# EAGLE design Radii (EAGLE 9.5.1)
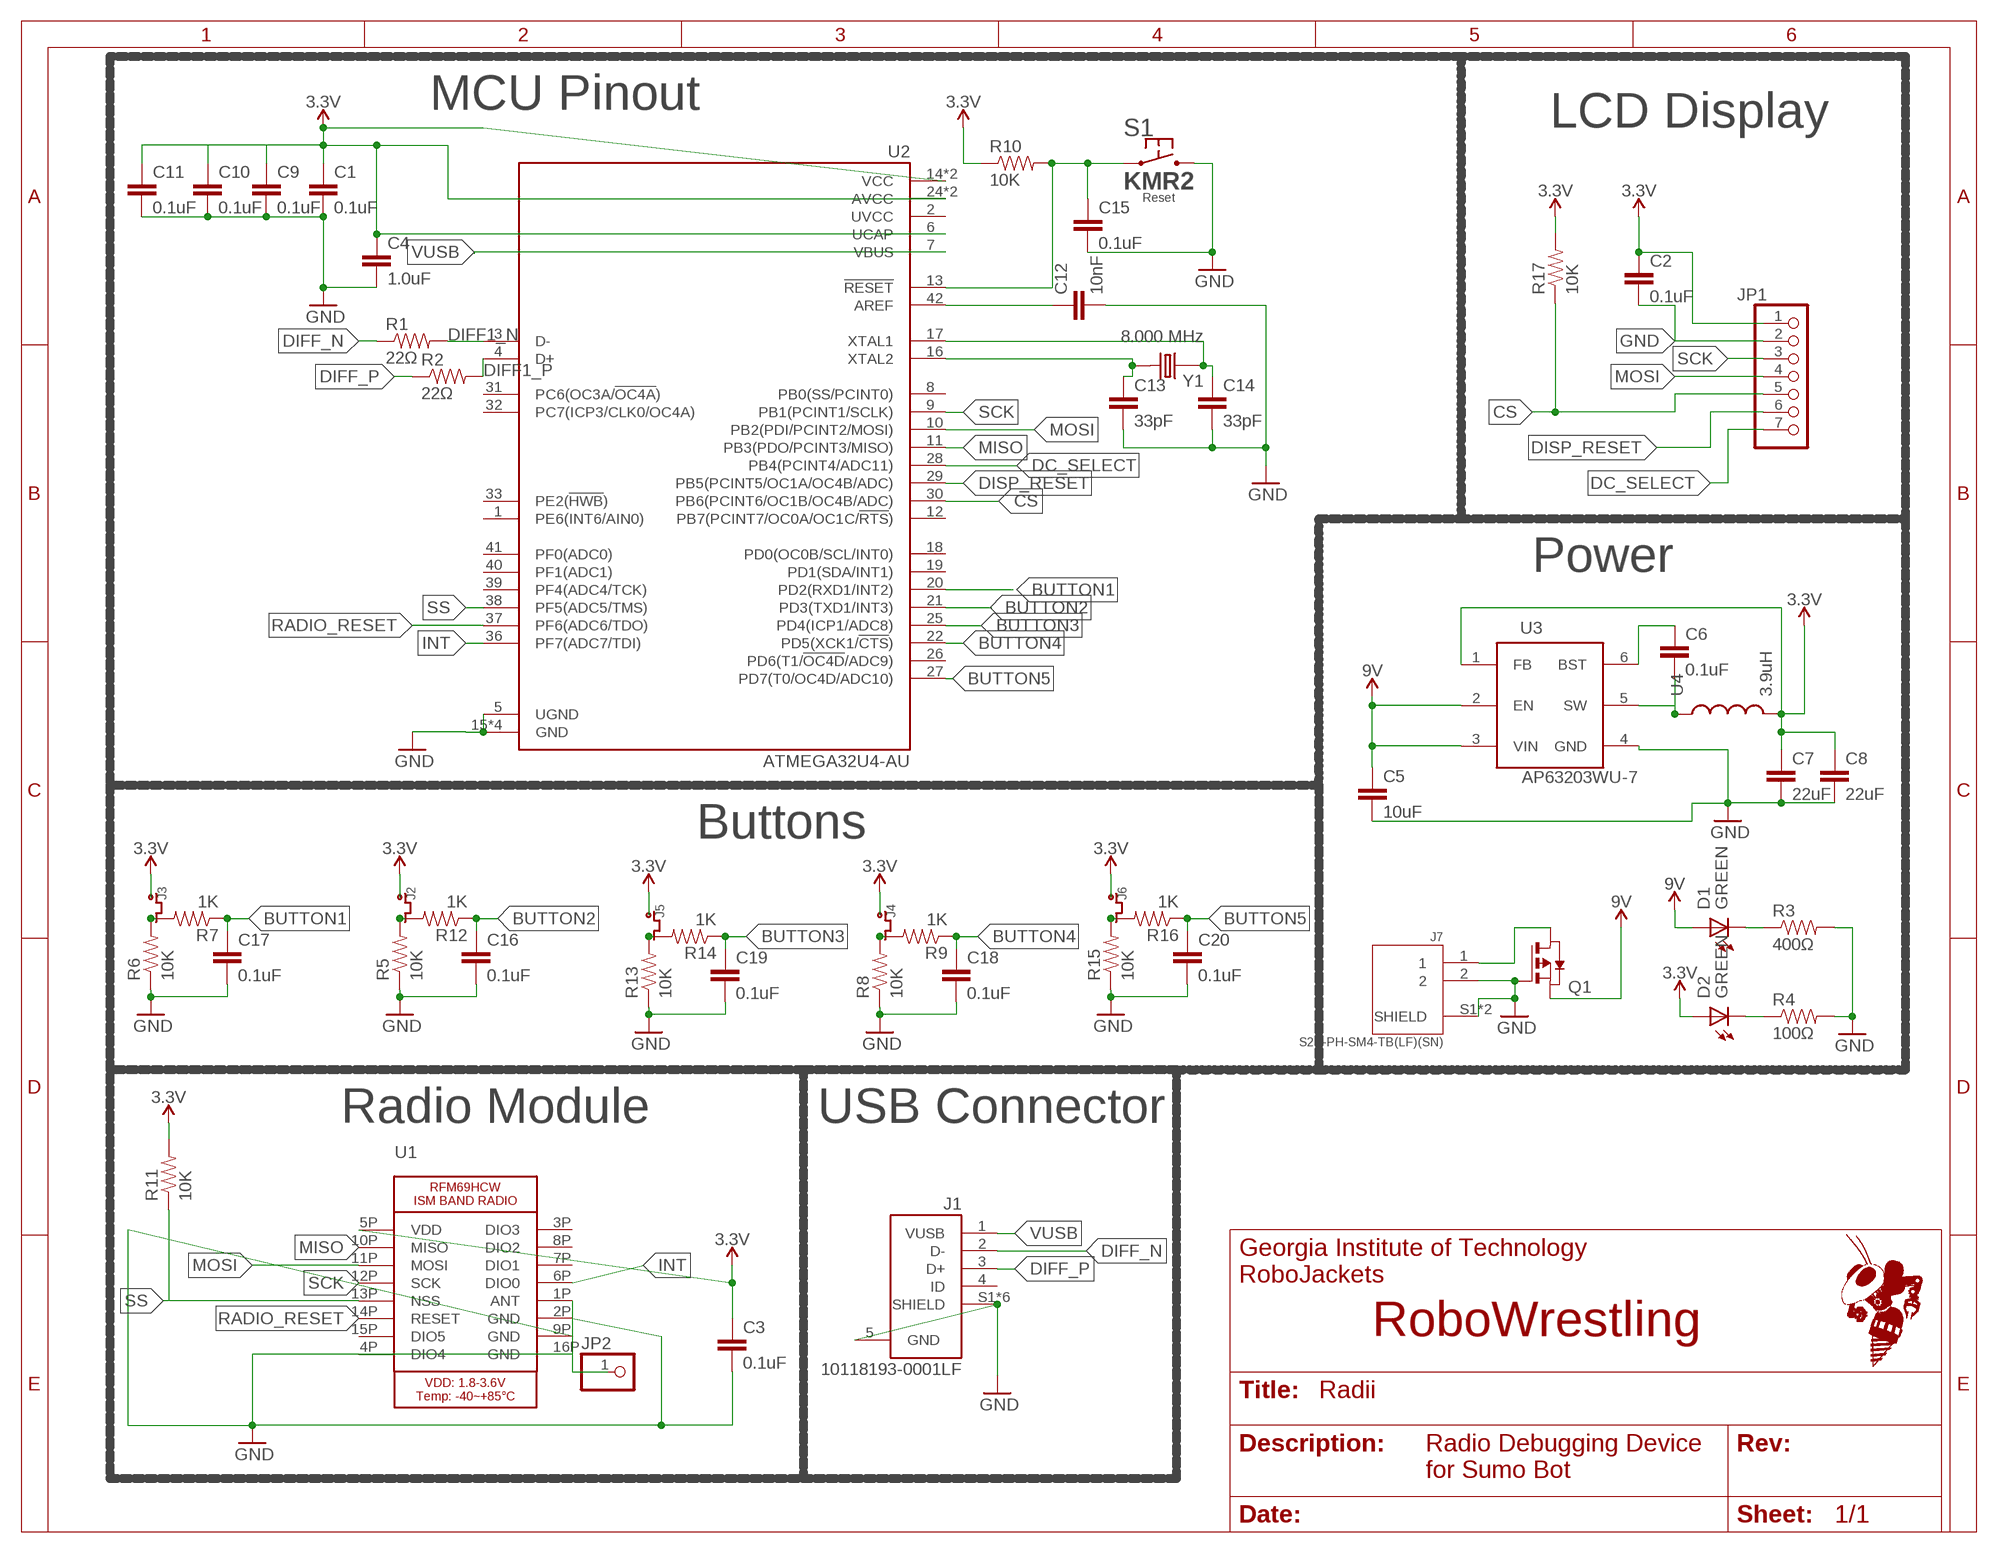
[diagram p0: schematic, sheet 1]

## Parts
C1  0.1uF  0.1UF-0603-25V-(+80/-20%)  [0603]
C2  0.1uF  0.1UF-0603-25V-(+80/-20%)  [0603]
C3  0.1uF  0.1UF-0603-25V-(+80/-20%)  [0603]
C4  1.0uF  1.0UF-0603-16V-10%  [0603]
C5  10uF  10UF-0603-6.3V-20%  [0603]
C6  0.1uF  0.1UF-0603-25V-(+80/-20%)  [0603]
C7  22uF  22UF-1210-16V-20%  [1210]
C8  22uF  22UF-1210-16V-20%  [1210]
C9  0.1uF  0.1UF-0603-25V-(+80/-20%)  [0603]
C10  0.1uF  0.1UF-0603-25V-(+80/-20%)  [0603]
C11  0.1uF  0.1UF-0603-25V-(+80/-20%)  [0603]
C12  10nF  10NF-0603-50V-10%  [0603]
C13  33pF  33PF-0603-50V-5%  [0603]
C14  33pF  33PF-0603-50V-5%  [0603]
C15  0.1uF  0.1UF-0603-25V-(+80/-20%)  [0603]
C16  0.1uF  0.1UF-0603-25V-(+80/-20%)  [0603]
C17  0.1uF  0.1UF-0603-25V-(+80/-20%)  [0603]
C18  0.1uF  0.1UF-0603-25V-(+80/-20%)  [0603]
C19  0.1uF  0.1UF-0603-25V-(+80/-20%)  [0603]
C20  0.1uF  0.1UF-0603-25V-(+80/-20%)  [0603]
D1  GREEN  LED-SMD  [CHIP-LED0603]
D2  GREEN  LED-SMD  [CHIP-LED0603]
J1  10118193-0001LF  [FCI_10118193-0001LF]
J2  BUTTON  [1X02]
J3  BUTTON  [1X02]
J4  BUTTON  [1X02]
J5  BUTTON  [1X02]
J6  BUTTON  [1X02]
J7  S2B-PH-SM4-TB(LF)(SN)  [JST_S2B-PH-SM4-TB(LF)(SN)]
JP1  PINHD-1X7  [1X07]
JP2  PINHD-1X1  [1X01]
Q1  PMOS  [SOT-23-3]
R1  22Ω  22OHM1/10W1%(0603)  [0603-RES]
R2  22Ω  22OHM1/10W1%(0603)  [0603-RES]
R3  400Ω  RESISTOR0603  [0603-RES]
R4  100Ω  RESISTOR0603  [0603-RES]
R5  10K  10KOHM-1/10W-1%(0603)0603  [0603-RES]
R6  10K  10KOHM-1/10W-1%(0603)0603  [0603-RES]
R7  1K  10KOHM-1/10W-1%(0603)0603  [0603-RES]
R8  10K  10KOHM-1/10W-1%(0603)0603  [0603-RES]
R9  1K  10KOHM-1/10W-1%(0603)0603  [0603-RES]
R10  10K  10KOHM-1/10W-1%(0603)0603  [0603-RES]
R11  10K  10KOHM-1/10W-1%(0603)0603  [0603-RES]
R12  1K  10KOHM-1/10W-1%(0603)0603  [0603-RES]
R13  10K  10KOHM-1/10W-1%(0603)0603  [0603-RES]
R14  1K  10KOHM-1/10W-1%(0603)0603  [0603-RES]
R15  10K  10KOHM-1/10W-1%(0603)0603  [0603-RES]
R16  1K  10KOHM-1/10W-1%(0603)0603  [0603-RES]
R17  10K  10KOHM-1/10W-1%(0603)0603  [0603-RES]
S1  KMR2  [KMR2]
U1  RFM69HCW_SMT  [RFMHCW_SMT]
U2  ATMEGA32U4-AU  ATMEGA32U4-AUR  [44-TQFP(10X10)]
U3  AP63203WU-7  [TSOT-23-6]
U4  3.9uH  1255AY-3R9N=P3  [1255AY-3R9N=P3]
Y1  8.000 MHz  ECS-80-20-5PX-TR  [XTAL_ECS-80-20-5PX-TR]

## Nets
3.3V: C1.1 C2.1 C3.1 C4.1 C7.1 C8.1 C9.1 C10.1 C11.1 D2.A J2.1 J3.1 J4.1 J5.1 J6.1 JP1.1 R10.1 R11.2 R17.2 U1.5P(VDD) U2.6(UCAP) U2.14(VCC) U2.24(AVCC) U2.34(VCC) U2.44(AVCC) U3.1(FB) U4.2
9V: C5.1 D1.A Q1.2(S) U3.2(EN) U3.3(VIN)
BUTTON1: C17.1 R7.1 U2.20(PD2(RXD1/INT2))
BUTTON2: C16.1 R12.1 U2.21(PD3(TXD1/INT3))
BUTTON3: C19.1 R14.1 U2.25(PD4(ICP1/ADC8))
BUTTON4: C18.1 R9.1 U2.22(PD5(XCK1/!CTS!))
BUTTON5: C20.1 R16.1 U2.27(PD7(T0/OC4D/ADC10))
CS: JP1.5 R17.1 U2.30(PB6(PCINT6/OC1B/OC4B/ADC))
DC_SELECT: JP1.7 U2.28(PB4(PCINT4/ADC11))
DIFF1_N: R1.2 U2.3(D-)
DIFF1_P: R2.2 U2.4(D+)
DIFF_N [diff]: J1.2(D-) R1.1
DIFF_P [diff]: J1.3(D+) R2.1
DISP_RESET: JP1.6 U2.29(PB5(PCINT5/OC1A/OC4B/ADC))
GND: C1.2 C2.2 C3.2 C4.2 C5.2 C7.2 C8.2 C9.2 C10.2 C11.2 C12.2 C13.2 C14.2 C15.2 C16.2 C17.2 C18.2 C19.2 C20.2 J1.5(GND) J1.S1(SHIELD) J1.S2(SHIELD) J1.S3(SHIELD) J1.S4(SHIELD) J1.S5(SHIELD) J1.S6(SHIELD) J7.2 J7.S1(SHIELD) J7.S2(SHIELD) JP1.2 Q1.1(G) R3.2 R4.2 R5.1 R6.1 R8.1 R13.1 R15.1 S1.2.1 S1.2.2 U1.2P(GND) U1.9P(GND) U1.16P(GND) U2.5(UGND) U2.15(GND) U2.23(GND) U2.35(GND) U2.43(GND) U3.4(GND)
INT: U1.6P(DIO0) U2.36(PF7(ADC7/TDI))
MISO: U1.10P(MISO) U2.11(PB3(PDO/PCINT3/MISO))
MOSI: JP1.4 U1.11P(MOSI) U2.10(PB2(PDI/PCINT2/MOSI))
N$1: C6.2 U3.5(SW) U4.1
N$2: C6.1 U3.6(BST)
N$3: JP2.1 U1.1P(ANT)
N$4: J3.2 R6.2 R7.2
N$6: C13.1 U2.16(XTAL2) Y1.2
N$7: C12.1 U2.42(AREF)
N$8: C14.1 U2.17(XTAL1) Y1.1
N$9: D1.C(K) R3.1
N$10: D2.C(K) R4.1
N$11: J2.2 R5.2 R12.2
N$12: J4.2 R8.2 R9.2
N$13: J5.2 R13.2 R14.2
N$14: J6.2 R15.2 R16.2
N$17: C15.1 R10.2 S1.1.1 S1.1.2 U2.13(!RESET)
RADIO_RESET: U1.14P(RESET) U2.37(PF6(ADC6/TDO))
SCK: JP1.3 U1.12P(SCK) U2.9(PB1(PCINT1/SCLK))
SS: R11.1 U1.13P(NSS) U2.38(PF5(ADC5/TMS))
VCC: J7.1 Q1.3(D)
VUSB: J1.1(VUSB) U2.7(VBUS)
Unconnected: J1.4(ID) U1.3P(DIO3) U1.4P(DIO4) U1.7P(DIO1) U1.8P(DIO2) U1.15P(DIO5) U2.1(PE6(INT6/AIN0)) U2.2(UVCC) U2.8(PB0(SS/PCINT0)) U2.12(PB7(PCINT7/OC0A/OC1C/!RTS!)) U2.18(PD0(OC0B/SCL/INT0)) U2.19(PD1(SDA/INT1)) U2.26(PD6(T1/!OC4D!/ADC9)) U2.31(PC6(OC3A/!OC4A!)) U2.32(PC7(ICP3/CLK0/OC4A)) U2.33(PE2(!HWB!)) U2.39(PF4(ADC4/TCK)) U2.40(PF1(ADC1)) U2.41(PF0(ADC0))

## Notes on the sheet
- MCU Pinout
- LCD Display
- Power
- Buttons
- Radio Module | USB Connector
- RoboWrestling
- Radio Debugging Device 
  for Sumo Bot

## Library data of the parts
C1-C3 C6 C9-C11 C15-C20 = SparkFun-Capacitors:0.1UF: 0.1µF ceramic capacitors A capacitor is a passive two-terminal electrical component used to store electrical energy temporarily in an electric field.; PROD_ID: CAP-00810
C4 = SparkFun-Capacitors:1.0UF: 1µF ceramic capacitors A capacitor is a passive two-terminal electrical component used to store electrical energy temporarily in an electric field.; PROD_ID: CAP-00868
C5 = SparkFun-Capacitors:10UF: 10.0µF ceramic capacitors A capacitor is a passive two-terminal electrical component used to store electrical energy temporarily in an electric field.; PROD_ID: CAP-11015
C7 C8 = SparkFun-Capacitors:22UF: 22µF ceramic capacitors A capacitor is a passive two-terminal electrical component used to store electrical energy temporarily in an electric field.
C12 = SparkFun-Capacitors:10NF: 0.01uF/10nF/10,000pF ceramic capacitors A capacitor is a passive two-terminal electrical component used to store electrical energy temporarily in an electric field. CAP-09321; PROD_ID: CAP-00867
C13 C14 = SparkFun-Capacitors:33PF: 33pF ceramic capacitors A capacitor is a passive two-terminal electrical component used to store electrical energy temporarily in an electric field.; PROD_ID: CAP-10142
D1 D2 = RoboJackets-LEDs:LED-SMD
J1 = I'mRADIOactive:10118193-0001LF: Micro USB B Type Receptacle; DKPN: 609-4616-1-ND
J2-J6 = I'mRADIOactive:BUTTON: Connector for a simple external button
J7 = I'mRADIOactive:S2B-PH-SM4-TB(LF)(SN): PH Series 2 Position 2 mm Pitch Surface Mount Side Entry Shrouded Header; DIGI-KEY_PART_NUMBER: 455-1749-1-ND
JP1 = I'mRADIOactive:PINHD-1X7: 7 PIN HEADER
JP2 = pinhead:PINHD-1X1: PIN HEADER
Q1 = RoboJackets-Discrete:PMOS
R1 R2 = SparkFun-Resistors:22OHM1/10W1%(0603): RES-08698; PROD_ID: RES-08698; VALUE: 22
R3 R4 = SparkFun-Resistors:RESISTOR: Resistor Basic schematic elements and footprints for 0603, 1206, and PTH resistors.
R5 R6 R8 R10 R11 R13 R15 R17 = SparkFun-Resistors:10KOHM-1/10W-1%(0603): RES-00824; PROD_ID: RES-00824
R7 R9 R12 R14 R16 = SparkFun-Resistors:10KOHM-1/10W-1%(0603): RES-00824; PROD_ID: RES-00824; VALUE: 10K
S1 = RoboJackets-Switches:KMR2; FUNCTION: Reset
U1 = I'mRADIOactive:RFM69HCW: RFM69HCW - ISM Band RF Transceiver; DKPN: 1568-1394-ND
U2 = I'mRADIOactive:ATMEGA32U4-AUR: ATmega Series 16 MHz 32 KB Flash 2.5 KB SRAM 8-Bit Microcontroller - TQFP-44; DKPN: ATMEGA32U4-AURDKR-ND
U3 = I'mRADIOactive:AP63203WU-7: 3.3V Switching Step-Down Power Regulator, Max Input 32V; DKPN: AP63203WU-7DICT-ND
U4 = I'mRADIOactive:1255AY-3R9N=P3: 3.9uH Inductor; DKPN: 490-14062-1-ND; SATURATION: 4.7A; TOLERANCE: ±30%
Y1 = I'mRADIOactive:ECS-80-20-5PX-TR: CRYSTAL SMD; DKPN: XC1271CT-ND

## Net classes
1 diff: width 0.004 mm

## Board
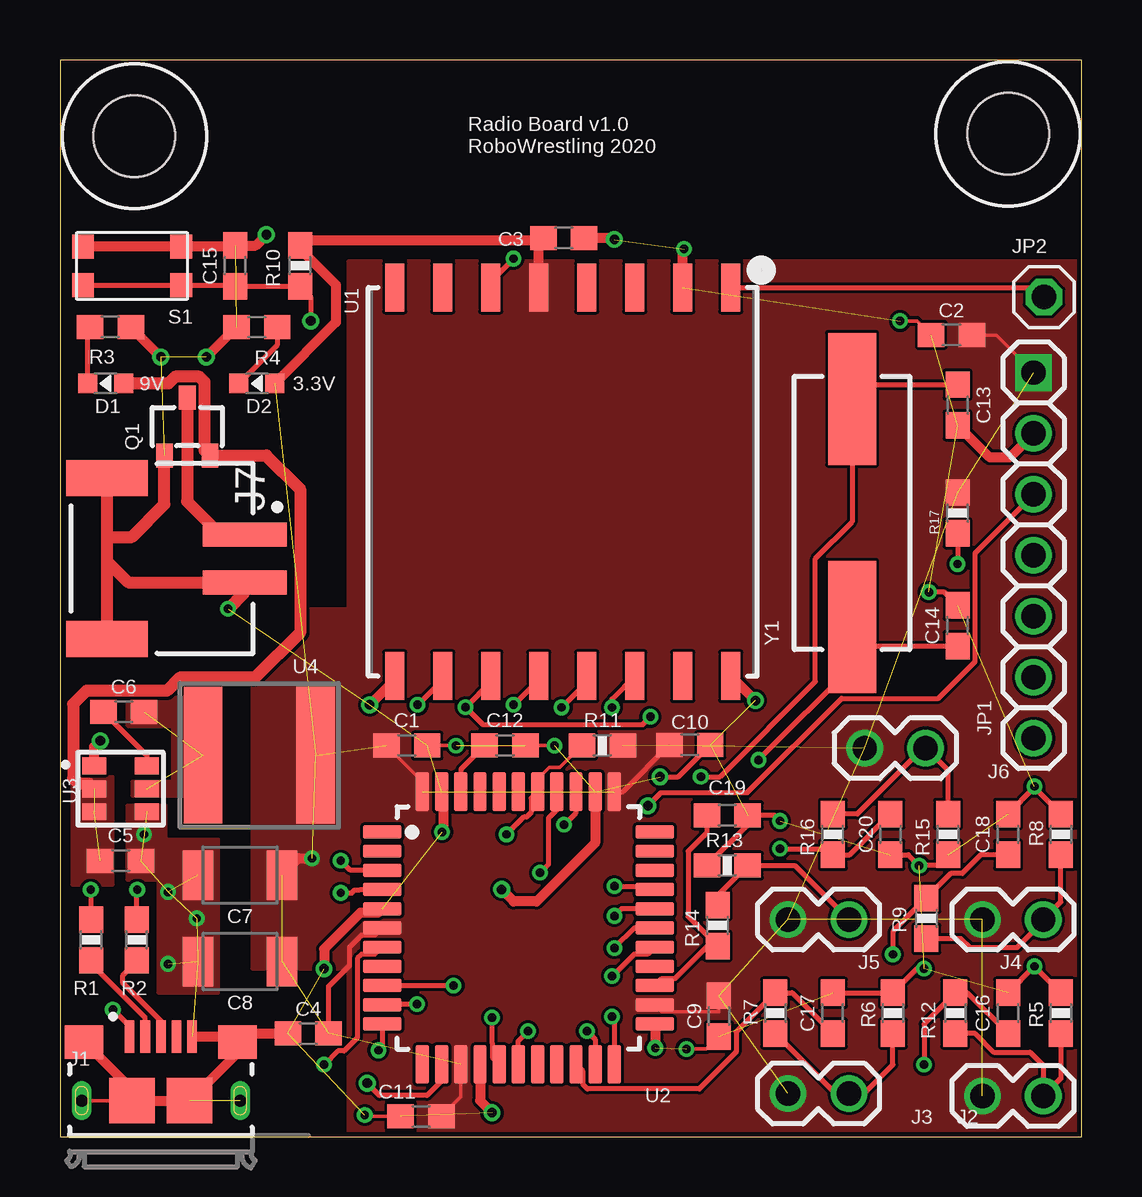
[diagram p1: board, top side]
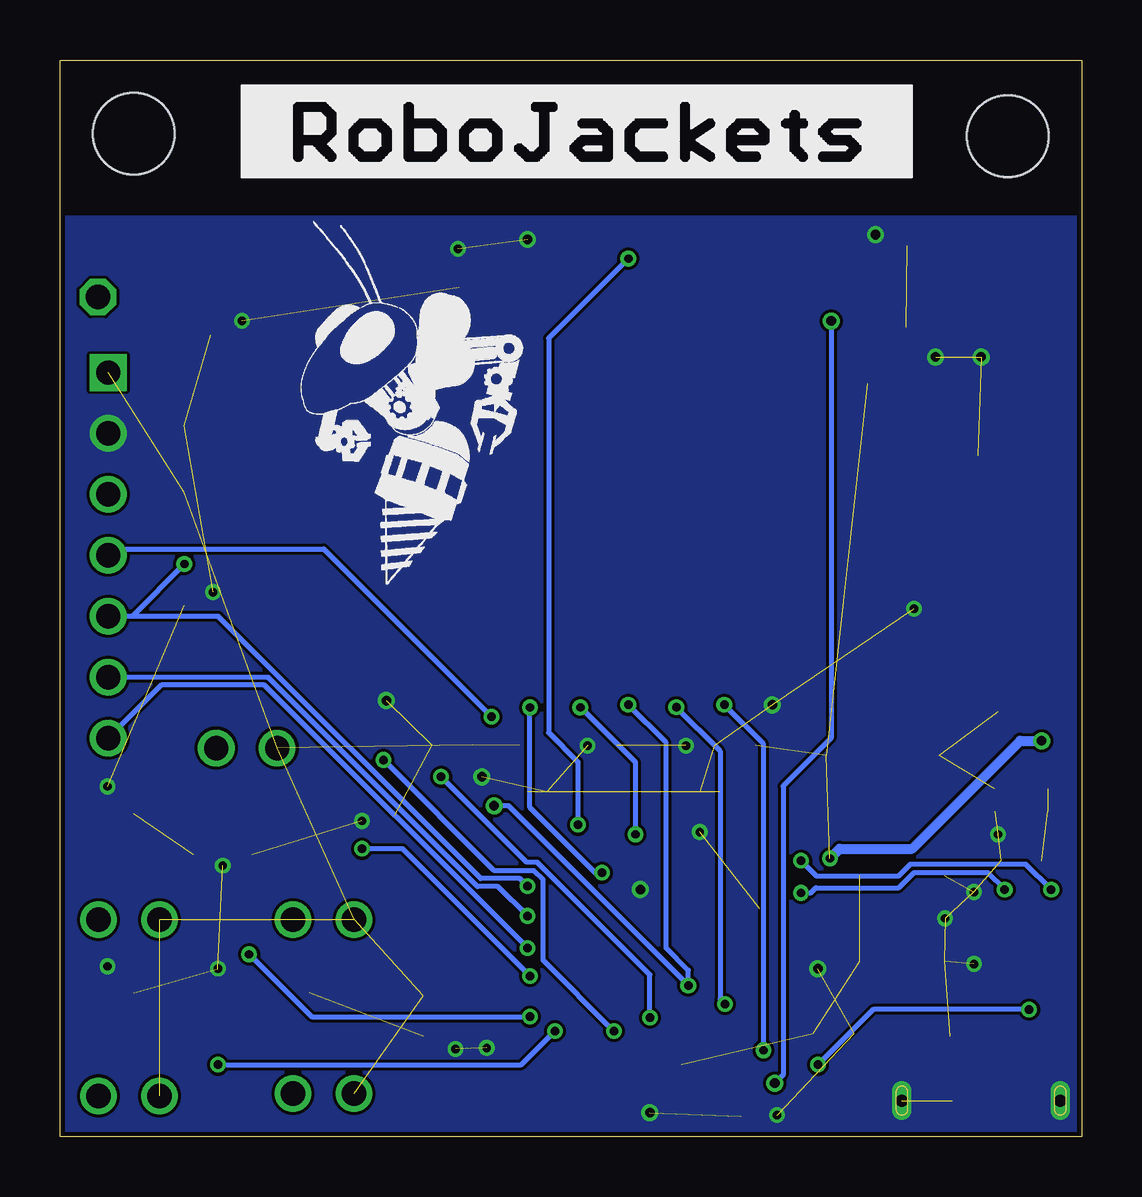
[diagram p2: board, bottom side, seen from below]

Size 42.58 x 44.88 mm. Coordinates in mm from the lower left corner, seen from the top.
Outline: 0,0 42.58,0 42.58,44.88 0,44.88 0,0
Copper layers (1+16): Top 0.035mm / dielectric 1.53mm / Bottom 0.035mm
Design rules "JLCPCB (2 Layer)": minimum track width 5mil, minimum drill 0.3mm, track to track 5mil, track to pad 5mil, pad to pad 5mil, via to via 20mil, smd to smd 5mil, copper to edge 0.2mm, drill to drill 21mil, minimum pad ring 6mil, minimum via ring 6mil, stop-mask expansion 6mil, vias tented up to drill 30mil, thermal gap 10mil
Holes 3.4 mm at 3.1,41.7 39.5,41.8

### Footprints (pad centres in the part's own frame; a part is rotated, then mirrored left to right if it is on the bottom)
0603 = smd 1.1 x 1: 1 -0.85,0; 2 0.85,0
1210 = smd 1.27 x 2.06: 1 -1.755,0; 2 1.755,0
CHIP-LED0603 = smd 0.8 x 0.8: A 0,-0.75; C 0,0.75
FCI_10118193-0001LF = smd 0.4 x 1.35: 1 -1.3,2.675; 2 -0.65,2.675; 3 0,2.675; 4 0.65,2.675; 5 1.3,2.675 | smd 1.6 x 1.4: S1 -3.2,2.45; S2 3.2,2.45 | smd 1.9 x 1.9: S3 1.2,0; S4 -1.2,0 | drill 0.5 long: S5 -3.3,0; S6 3.3,0
1X02 = drill 1.016: 1 -1.27,0; 2 1.27,0
JST_S2B-PH-SM4-TB(LF)(SN) = smd 1 x 3.5: 1 -1,3; 2 1,3 | smd 1.5 x 3.4: S1 -3.35,-2.75; S2 3.35,-2.75
1X07 = drill 1.016 square: 1 -7.62,0 | drill 1.016: 2 -5.08,0; 3 -2.54,0; 4 0,0; 5 2.54,0; 6 5.08,0; 7 7.62,0
1X01 = drill 1.016 octagon: 1 0,0
SOT-23-3 = smd 0.7 x 1: 1 -0.95,-1.2; 2 0.95,-1.2; 3 0,1.2
0603-RES = smd 1.1 x 1: 1 -0.85,0; 2 0.85,0
KMR2 = smd 0.9 x 1: 1.1 -2.05,0.8; 1.2 2.05,0.8; 2.1 -2.05,-0.8; 2.2 2.05,-0.8
RFMHCW_SMT = smd 2 x 0.8: 1P 8.1,-7; 2P 8.1,-5; 3P 8.1,-3; 4P 8.1,-1; 5P 8.1,1; 6P 8.1,3; 7P 8.1,5; 8P 8.1,7; 9P -8.1,7; 10P -8.1,5; 11P -8.1,3; 12P -8.1,1; 13P -8.1,-1; 14P -8.1,-3; 15P -8.1,-5; 16P -8.1,-7
44-TQFP(10X10) = smd 1.6 x 0.55: 1 -5.68,4; 2 -5.68,3.2; 3 -5.68,2.4; 4 -5.68,1.6; 5 -5.68,0.8; 6 -5.68,0; 7 -5.68,-0.8; 8 -5.68,-1.6; 9 -5.68,-2.4; 10 -5.68,-3.2; 11 -5.68,-4; 23 5.68,-4; 24 5.68,-3.2; 25 5.68,-2.4; 26 5.68,-1.6; 27 5.68,-0.8; 28 5.68,0; 29 5.68,0.8; 30 5.68,1.6; 31 5.68,2.4; 32 5.68,3.2; 33 5.68,4 | smd 0.55 x 1.6: 12 -4,-5.68; 13 -3.2,-5.68; 14 -2.4,-5.68; 15 -1.6,-5.68; 16 -0.8,-5.68; 17 0,-5.68; 18 0.8,-5.68; 19 1.6,-5.68; 20 2.4,-5.68; 21 3.2,-5.68; 22 4,-5.68; 34 4,5.68; 35 3.2,5.68; 36 2.4,5.68; 37 1.6,5.68; 38 0.8,5.68; 39 0,5.68; 40 -0.8,5.68; 41 -1.6,5.68; 42 -2.4,5.68; 43 -3.2,5.68; 44 -4,5.68
TSOT-23-6 = smd 1 x 0.7: 1 -1.099,0.95; 2 -1.099,0; 3 -1.099,-0.95; 4 1.099,-0.95; 5 1.099,0; 6 1.099,0.95
1255AY-3R9N=P3 = smd 1.6 x 5.7: 1 -2.35,0; 2 2.35,0
XTAL_ECS-80-20-5PX-TR = smd 5.5 x 2: 1 -4.75,0; 2 4.75,0

### Placement (x,y rotation side)
C1  14.45,16.3 0 top
C2  37.15,33.42 180 top
C3  20.99,37.46 0 top
C4  10.35,4.3 180 top
C5  2.52,11.5 0 top
C6  2.65,17.7 0 top
C7  7.5,10.9 180 top
C8  7.5,7.3 180 top
C9  27.45,5.03 270 top
C10  26.25,16.32 0 top
C11  15.04,0.85 180 top
C12  18.54,16.3 0 top
C13  37.4,30.5 270 top
C14  37.4,21.3 90 top
C15  7.3,36.3 90 top
C16  39.5,5.15 90 top
C17  32.2,5.15 90 top
C18  39.5,12.6 90 top
C19  27.8,13.4 0 top
C20  34.6,12.6 270 top
D1  1.9,31.4 90 top
D2  8.2,31.4 90 top
J1  4.2,1.5 0 top
J2  39.7,1.7 0 top
J3  31.6,1.8 0 top
J4  39.7,9.05 0 top
J5  31.6,9.05 0 top
J6  34.8,16.2 0 top
J7  4.7,24.1 270 top
JP1  40.57,24.23 270 top
JP2  41,35 0 top
Q1  5.3,29.6 0 top
R1  1.3,8.2 90 top
R2  3.2,8.2 90 top
R3  [0603]  2.1,33.75 0 top
R4  [0603]  8.2,33.75 180 top
R5  41.7,5.15 270 top
R6  34.7,5.15 270 top
R7  29.8,5.15 270 top
R8  41.7,12.6 270 top
R9  36.1,9.1 270 top
R10  10,36.3 270 top
R11  22.6,16.3 0 top
R12  37.3,5.15 270 top
R13  27.8,11.3 0 top
R14  27.4,8.8 90 top
R15  37,12.6 90 top
R16  32.2,12.6 90 top
R17  37.4,26 90 top
S1  3,36.3 180 top
U1  20.95,27.3 90 top
U2  19.1,8.7 0 top
U3  2.52,14.5 0 top
U4  8.3,15.9 0 top
U$1  [ROBOBUZZ_0.8X]  29,23 0 bottom
U$2  [ROBOJACKETS]  35,40 0 bottom
Y1  33,26 90 top

### Tracks (layer width: path | path; a pad name or v marks a point on that pad's centre or on a via)
3.3V  (via drill 0.35, 0.4)  (16 unrouted)
  Top 0.152: U2.14 16.7,1.66 C11.1 | C1.1 15.1,14.8 U2.44 | C2.1 39,33.42 JP1.1 | U2.24 25.08,5.2 27.45,5.2 C9.1
  Top 0.2: C10.1 23.45,14.38 U2.34 | U2.6 13.12,8.4 12.57,8.4 12.07,7.9 12.07,7.14 11.2,6.27 C4.1
  Top 0.406: C7.1 9.96,11.6 v10.5,11.6 | v1.68,16.5 1.42,16.25 U3.1 | U1.5P 19.95,37.35 | 19.95,37.35 19.95,37.66 C3.1 | 19.95,37.35 19.94,37.35 10.2,37.35 R10.1 10,37 11.49,35.51 11.49,33.95 D2.A
  Bottom 0.406: v10.5,11.6 10.1,12 7.08,12 2.58,16.5 v1.68,16.5
  pour Top (no thermals): 8,22 12,22 12,7 8,7
  pour Top (no thermals): 12,36.5 12,0 43,0 43,36.5
9V  (2 unrouted)
  Top 0.508: D1.A 4.51,31.4 4.79,31.68 5.81,31.68 6.03,31.46 6.03,28.62 Q1.2 8.6,28.4 10,27 10,21 8.13,19.13 4.99,19.13 4.44,18.58 1.1,18.58 0.54,18.03 0.54,14.94 0.77,14.72 1.2,14.72 U3.2
  pour Top (no thermals): 0.5,15 2.2,15 2.2,10.5 0.5,10.5
BUTTON1
  Top 0.2: C17.1 30.5,6 R7.1 28.18,4.38 28.18,3.53 26.64,1.99 21.97,1.99 21.8,2.17 21.8,2.72 U2.20
BUTTON2  (via drill 0.35)
  Top 0.2: C16.1 37.8,6 R12.1 36,4.7 v36,3 | v21.95,4.4 22.3,4.06 U2.21
  Bottom 0.2: v36,3 23.36,3 v21.95,4.4
BUTTON3
  Top 0.2: C19.1 26.95,12.67 26.17,11.89 26.17,9.18 R14.1 26.99,7.95 25.63,6.6 25.08,6.6 U2.25
BUTTON4  (via drill 0.35)
  Top 0.2: C18.1 38.37,11.75 37.59,10.97 37.12,10.97 R9.1 34.7,8.55 v34.7,7.6 | v23,5 23.1,4.9 U2.22
  Bottom 0.2: v34.7,7.6 32.1,5 v23,5
BUTTON5  (via drill 0.35)
  Top 0.2: C20.1 32.9,11.75 R16.1 31.95,12 v30,12 | U2.27 24.48,7.6 23.93,7.6 23.02,6.7 v23,6.7
  Bottom 0.2: v23,6.7 28.3,12 v30,12
CS  (via drill 0.35)
  Top 0.2: v23.1,10.44 24.64,10.44 U2.30 | R17.1 v37.4,23.87
  Bottom 0.2: v23.1,10.44 23.42,10.76 25.05,10.76 35.98,21.69 JP1.5 39.58,21.69 v37.4,23.87
DC_SELECT  (via drill 0.35)
  Top 0.2: U2.28 23.94,8.7 v23.1,7.86
  Bottom 0.2: v23.1,7.86 34.06,18.82 38.36,18.82 JP1.7
DIFF1_N  (via drill 0.35)
  Top 0.2: U2.3 12.1,11.1 v11.7,11.5 | R1.2 1.3,10.28 v1.28,10.3
  Bottom 0.2: v1.28,10.3 2.33,11.35 7.15,11.35 7.65,10.85 11.05,10.85 v11.7,11.5
DIFF1_P  (via drill 0.35)
  Top 0.2: U2.4 12.49,10.3 12.47,10.28 12.28,10.28 12.16,10.16 v11.7,10.16 | v3.22,10.3 3.2,10.28 R2.2
  Bottom 0.2: v3.22,10.3 3.92,11 7,11 7.62,10.38 11.08,10.38 11.3,10.16 v11.7,10.16
DIFF_N
  Top 0.2: J1.2 3.55,4.95 1.3,7.2 R1.1
DIFF_P
  Top 0.2: J1.3 4.2,4.83 2.6,6.43 2.6,6.7 3.2,7.3 R2.1
DISP_RESET  (via drill 0.35)
  Top 0.2: U2.29 23.4,9.5 v23.1,9.2
  Bottom 0.2: JP1.6 33.9,19.15 25.19,10.43 24.33,10.43 v23.1,9.2
GND  (via drill 0.35, 0.4)  (35 unrouted)
  Top 0.152: C11.2 12.75,0.85 v12.7,0.9 | C1.2 v16.5,16.3 | C12.2 v20.6,16.3 | C2.2 35.72,34 v35,34 | v26.1,3.66 26.93,3.66 C9.2 | J1.S5 J1.S4
  Top 0.2: C10.2 25.77,15 v25,15 | v36,7 35.7,7 R6.1 C17.2 | C16.2 v40.6,7.1 R5.1 | v30,13.16 29.76,13.4 C19.2 28.65,13 R13.1 | C20.2 35.35,11.75 v35.8,11.3 36.55,11.3 R15.1 | C18.2 40.6,14.55 | R8.1 40.6,14.55 | 40.6,14.55 v40.6,14.6 | C14.2 36.85,22.7 v36.2,22.7
  Top 0.406: J1.5 7.17,4.17 J1.S2 | J1.S1 2.9,2.05 2.9,1.5 J1.S4 J1.S3 7.4,3.5 J1.S2 | JP1.2 39.57,28.31 38.74,28.31 C13.2 | U2.23 24.8,4.68 v24.8,3.7 | U2.15 17.5,1.5 v18,1 | v26,37 25.95,37.05 U1.2P | U2.5 13.25,9.33 12.51,9.33 11,7.82 v11,7 | v28.98,18.18 28.96,18.18 U1.16P | U1.9P 13.95,19.05 v12.9,18 | U2.43 15.97,14.31 15.97,12.75 v15.92,12.7 | v18.4,10.3 18.9,9.8 19.86,9.8 22.3,12.24 U2.35 | S1.2.2 S1.2.1 7.25,37.1 C15.2 8.15,37.15 v8.6,37.6 | R3.2 v4.2,32.5 | R4.2 v6.1,32.5 | v23.1,37.4 23.04,37.46 C3.2 | J1.S2 7.75,4.3 C4.2
  Top 0.508: J7.2 7.56,23.24 | J7.2 7.64,22.64 v7,22 | J7.S1 1.95,25 | 1.95,25 1.95,24 | 1.95,24 J7.S2 | 1.95,24 2.85,23.1 J7.2 | 1.95,25 3,25 4.35,26.35 Q1.1
  other vias: 5.7,9.1 4.5,7.2 4.5,10.2 3.5,12.6
  pour Bottom (no thermals): 0,-0.1 42.9,-0.1 42.9,38.3 0,38.3
  pour Top (no thermals): 2.8,13.8 4.4,13.8 4.4,10.7 2.8,10.7
  pour Top (no thermals): 6.6,12.4 6.6,6 4.1,6 4.1,12.4
INT  (via drill 0.35)
  Top 0.2: v18.9,36.6 17.95,35.65 U1.6P | v21,13 21.5,13.5 U2.36
  Bottom 0.2: v21,13 21,15.62 22.22,16.84 22.22,33.28 v18.9,36.6
MISO  (via drill 0.35)
  Top 0.2: U1.10P 15.95,19.05 v14.9,18 | U2.11 13.42,3.75 v13.27,3.6
  Bottom 0.2: v14.9,18 13.27,16.37 v13.27,3.6
MOSI  (via drill 0.35)
  Top 0.2: U1.11P 17.95,18.95 v16.9,17.9 17.64,17.16 24.26,17.16 v24.6,17.5 | U2.10 13.45,5.53 v14.87,5.53
  Bottom 0.2: v24.6,17.5 31.6,24.5 40.3,24.5 JP1.4 | v14.87,5.53 15.08,5.73 15.08,16.08 v16.9,17.9
N$1  (2 unrouted)
  pour Top (no thermals): 2.8,18.3 6.5,18.3 6.5,14.2 3,14.2 3,14.8 4.7,14.8 4.7,17.1 2.8,17.1
N$2
  Top 0.2: C6.1 3.62,15.88 U3.6
N$3
  Top 0.2: U1.1P 40.6,35.4 JP2.1
N$4
  Top 0.2: R6.2 34.7,3 33.5,1.8 33,1.8 J3.2 32.3,1.8 R7.2
N$6  (via drill 0.35)
  Top 0.2: C13.1 33.6,31.35 Y1.2 33,25.62 31.47,24.09 31.47,18.97 27.5,15 v26.7,15 | U2.16 18.03,3.29 18.03,3.88 18,3.91 v18,4.97
  Bottom 0.2: v26.7,15 23.14,11.44 22.69,11.44 18,6.75 v18,4.97
N$7
  Top 0.2: C12.1 16.7,15.31 U2.42
N$8  (via drill 0.35)
  Top 0.2: Y1.1 33.12,21.12 | 33.12,21.12 33.8,20.45 C14.1 | U2.17 19.1,4 v19.5,4.4 | v29.1,15.7 33.12,19.73 33.12,21.12
  Bottom 0.2: v19.5,4.4 22.45,7.35 22.45,10.71 22.83,11.09 24.49,11.09 v29.1,15.7
N$9
  Top 0.2: D1.C 1.15,33.65 R3.1
N$10
  Top 0.2: R4.1 9.05,33 D2.C
N$11
  Top 0.2: R5.2 41.7,2.43 J2.2 40.97,2.97 40.42,3.52 38.91,3.52 38.13,4.3 R12.2
N$12
  Top 0.2: R9.2 37.55,8.25 37.92,7.88 39.88,7.88 40.97,8.97 J4.2 41.7,9.78 R8.2
N$13
  Top 0.2: R14.2 27.4,10.05 R13.2 30.62,11.3 J5.2
N$14
  Top 0.2: R16.2 33.23,13.45 35.98,16.2 J6.2 37,15.27 R15.2
N$17  (via drill 0.4)
  Top 0.2: S1.1.2 S1.1.1 7.25,35.5 C15.1 R10.2 10.45,35 v10.45,34 | U2.13 15.9,2.32 15.3,1.72 13.31,1.72 v12.8,2.23
  Bottom 0.2: v10.45,34 10.45,16.61 12.45,14.61 12.45,2.58 v12.8,2.23
RADIO_RESET  (via drill 0.35)
  Top 0.2: U1.14P 23,18.25 v23,17.89 | U2.37 20.7,13.61 20.35,13.27 20.35,11.35 v20,11
  Bottom 0.2: v23,17.89 23,13.72 20.28,11 v20,11
SCK  (via drill 0.35, 0.4)
  Top 0.2: U2.9 v16.4,6.3 | U1.12P 19.95,19.05 v18.9,18 | v24.49,13.79 25.04,14.34 28.64,14.34 32.56,18.27 36.59,18.27 38.13,19.81 38.13,24.33 JP1.3
  Bottom 0.2: v18.9,18 17.32,16.42 17.32,7.87 16.4,6.94 v16.4,6.3 23.89,13.79 v24.49,13.79
SS  (via drill 0.35)
  Top 0.152: R11.1 20.83,15.38 20.38,15.38 19.9,14.9 U2.38
  Top 0.2: U1.13P 21.95,18.93 v20.9,17.89 | U2.38 19.63,14.11 19.63,13.52 19.44,13.33 19.33,13.33 v18.6,12.6
  Bottom 0.2: v18.6,12.6 18.6,15.6 20.89,17.89 v20.9,17.89
VCC
  Top 0.508: Q1.3 5.3,26.48 6.68,25.1 J7.1
VUSB  (via drill 0.35)
  Top 0.2: v2.2,5.3 2.9,4.6 J1.1 | v11,3 11.57,3.57 11.84,3.57 12.39,4.13 12.39,7.43 12.57,7.6 13.12,7.6 U2.7
  Bottom 0.2: v2.2,5.3 8.7,5.3 v11,3

### Text on the board
tPlace: Radio Board v1.0 / RoboWrestling 2020 | 9V | 3.3V